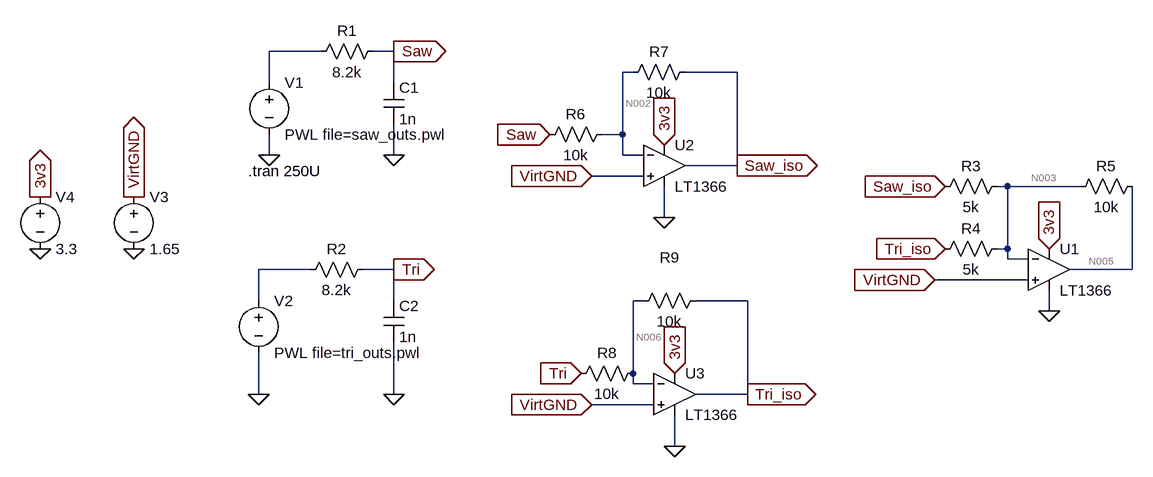
[diagram p0: schematic PulseWidthDAC.asc]
PulseWidthDAC.asc, the LTspice schematic file:
Version 4
SHEET 1 1768 708
WIRE 128 80 48 80
WIRE 240 80 208 80
WIRE 608 112 592 112
WIRE 768 112 688 112
WIRE 48 128 48 80
WIRE 240 128 240 80
WIRE 592 208 592 112
WIRE 592 208 560 208
WIRE 48 240 48 208
WIRE 240 240 240 192
WIRE 592 240 592 208
WIRE 624 240 592 240
WIRE 768 256 768 112
WIRE 768 256 688 256
WIRE 624 272 544 272
WIRE 1184 288 1168 288
WIRE 1296 288 1184 288
WIRE 656 336 656 288
WIRE 1184 384 1184 288
WIRE 1184 384 1168 384
WIRE 1184 400 1184 384
WIRE 1216 400 1184 400
WIRE 112 416 32 416
WIRE 240 416 192 416
WIRE 1376 416 1376 288
WIRE 1376 416 1280 416
WIRE 1216 432 1072 432
WIRE 32 464 32 416
WIRE 240 464 240 416
WIRE 624 464 608 464
WIRE 784 464 704 464
WIRE 1248 480 1248 448
WIRE 608 576 608 464
WIRE 608 592 608 576
WIRE 640 592 608 592
WIRE 32 608 32 544
WIRE 240 608 240 528
WIRE 784 608 784 464
WIRE 784 608 704 608
WIRE 640 624 544 624
WIRE 672 688 672 640
FLAG 240 240 0
FLAG 48 240 0
FLAG 240 608 0
FLAG 32 608 0
FLAG 240 80 Saw
IOPIN 240 80 Out
FLAG 240 416 Tri
IOPIN 240 416 Out
FLAG -160 384 0
FLAG 1248 480 0
FLAG 1248 384 3v3
IOPIN 1248 384 In
FLAG -304 384 0
FLAG -304 304 3v3
IOPIN -304 304 Out
FLAG -160 304 VirtGND
IOPIN -160 304 Out
FLAG 1072 432 VirtGND
IOPIN 1072 432 In
FLAG 544 624 VirtGND
IOPIN 544 624 In
FLAG 544 272 VirtGND
IOPIN 544 272 In
FLAG 656 336 0
FLAG 672 688 0
FLAG 672 576 3v3
IOPIN 672 576 In
FLAG 656 224 3v3
IOPIN 656 224 In
FLAG 480 208 Saw
IOPIN 480 208 In
FLAG 528 576 Tri
IOPIN 528 576 In
FLAG 768 256 Saw_iso
IOPIN 768 256 Out
FLAG 784 608 Tri_iso
IOPIN 784 608 Out
FLAG 1088 288 Saw_iso
IOPIN 1088 288 In
FLAG 1088 384 Tri_iso
IOPIN 1088 384 In
SYMBOL voltage 48 112 R0
WINDOW 123 0 0 Left 0
WINDOW 39 0 0 Left 0
SYMATTR InstName V1
SYMATTR Value PWL file=saw_outs.pwl
SYMBOL res 224 64 R90
WINDOW 0 0 56 VBottom 2
WINDOW 3 32 56 VTop 2
SYMATTR InstName R1
SYMATTR Value 8.2k
SYMBOL cap 224 128 R0
SYMATTR InstName C1
SYMATTR Value 1n
SYMBOL voltage 32 448 R0
WINDOW 123 0 0 Left 0
WINDOW 39 0 0 Left 0
SYMATTR InstName V2
SYMATTR Value PWL file=tri_outs.pwl
SYMBOL res 208 400 R90
WINDOW 0 0 56 VBottom 2
WINDOW 3 32 56 VTop 2
SYMATTR InstName R2
SYMATTR Value 8.2k
SYMBOL cap 224 464 R0
SYMATTR InstName C2
SYMATTR Value 1n
SYMBOL OpAmps\\LT1366 1248 352 R0
SYMATTR InstName U1
SYMBOL voltage -160 288 R0
WINDOW 123 0 0 Left 0
WINDOW 39 0 0 Left 0
SYMATTR InstName V3
SYMATTR Value 1.65
SYMBOL res 1184 272 R90
WINDOW 0 0 56 VBottom 2
WINDOW 3 32 56 VTop 2
SYMATTR InstName R3
SYMATTR Value 5k
SYMBOL res 1184 368 R90
WINDOW 0 0 56 VBottom 2
WINDOW 3 32 56 VTop 2
SYMATTR InstName R4
SYMATTR Value 5k
SYMBOL res 1392 272 R90
WINDOW 0 0 56 VBottom 2
WINDOW 3 32 56 VTop 2
SYMATTR InstName R5
SYMATTR Value 10k
SYMBOL voltage -304 288 R0
WINDOW 123 0 0 Left 0
WINDOW 39 0 0 Left 0
SYMATTR InstName V4
SYMATTR Value 3.3
SYMBOL OpAmps\\LT1366 656 192 R0
SYMATTR InstName U2
SYMBOL OpAmps\\LT1366 672 544 R0
SYMATTR InstName U3
SYMBOL res 576 192 R90
WINDOW 0 0 56 VBottom 2
WINDOW 3 32 56 VTop 2
SYMATTR InstName R6
SYMATTR Value 10k
SYMBOL res 704 96 R90
WINDOW 0 0 56 VBottom 2
WINDOW 3 32 56 VTop 2
SYMATTR InstName R7
SYMATTR Value 10k
SYMBOL res 624 560 R90
WINDOW 0 0 56 VBottom 2
WINDOW 3 32 56 VTop 2
SYMATTR InstName R8
SYMATTR Value 10k
SYMBOL res 720 448 R90
WINDOW 0 -35 56 VBottom 2
WINDOW 3 32 56 VTop 2
SYMATTR InstName R9
SYMATTR Value 10k
TEXT 16 264 Left 2 !.tran 250U

The netlist it stands for:
* PulseWidthDAC.asc
V1 N001 0 PWL file=saw_outs.pwl
R1 Saw N001 8.2k
C1 Saw 0 1n
V2 N004 0 PWL file=tri_outs.pwl
R2 Tri N004 8.2k
C2 Tri 0 1n
XU1 VirtGND N003 3v3 0 N005 LT1366  ; pins In+ In- V+ V- OUT
V3 VirtGND 0 1.65
R3 N003 Saw_iso 5k
R4 N003 Tri_iso 5k
R5 N005 N003 10k
V4 3v3 0 3.3
XU2 VirtGND N002 3v3 0 Saw_iso LT1366  ; pins In+ In- V+ V- OUT
XU3 VirtGND N006 3v3 0 Tri_iso LT1366  ; pins In+ In- V+ V- OUT
R6 N002 Saw 10k
R7 Saw_iso N002 10k
R8 N006 Tri 10k
R9 Tri_iso N006 10k
.tran 250U
.lib LTC.lib
.backanno
.end

* Results of the author's LTspice run, read from the files saved beside the schematic
* Operating Point, zero values left out:
*   V(saw) = 743.4 mV
*   V(tri) = 743.4 mV
*   V(n003) = 2.047 V
*   V(virtgnd) = 1.65 V
*   V(3v3) = 3.3 V
*   V(n005) = 9.114 mV
*   V(saw_iso) = 2.556 V
*   V(tri_iso) = 2.556 V
*   V(n002) = 1.65 V
*   V(n006) = 1.65 V
*   I(R1) = 90.66 µA
*   I(R2) = 90.66 µA
*   I(R3) = -101.9 µA
*   I(R4) = -101.9 µA
*   I(R5) = -203.8 µA
*   I(R6) = 90.66 µA
*   I(R7) = 90.65 µA
*   I(R8) = 90.66 µA
*   I(R9) = 90.65 µA
*   I(V1) = 90.66 µA
*   I(V2) = 90.66 µA
*   I(V3) = 29.97 nA
*   I(V4) = -1.353 mA
*   Ix(u1:1) = -9.99 nA
*   Ix(u1:2) = -9.95 nA
*   Ix(u1:3) = 322.8 µA
*   Ix(u1:4) = -526.6 µA
*   Ix(u1:5) = 203.8 µA
*   Ix(u2:1) = -9.99 nA
*   Ix(u2:2) = -9.99 nA
*   Ix(u2:3) = 515.3 µA
*   Ix(u2:4) = -322.8 µA
*   Ix(u2:5) = -192.5 µA
*   Ix(u3:1) = -9.99 nA
*   Ix(u3:2) = -9.99 nA
*   Ix(u3:3) = 515.3 µA
*   Ix(u3:4) = -322.8 µA
*   Ix(u3:5) = -192.5 µA
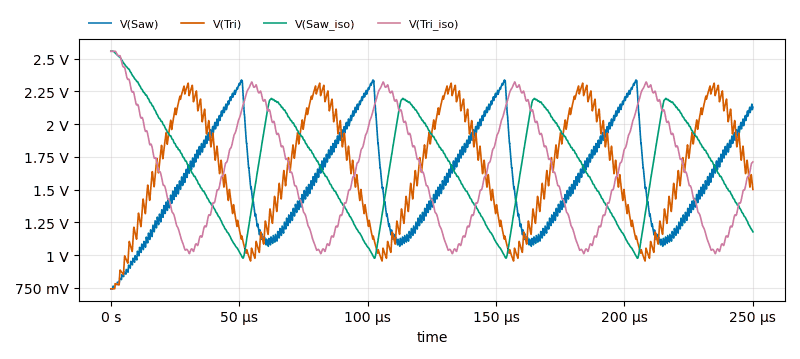
[diagram p1: Transient Analysis of PulseWidthDAC.asc, plotted from the saved traces]
* Transient Analysis, 1 run:
*   V(Saw): min 743.4 mV, max 2.338 V, average 1.587 V, rms 1.637 V, last 2.131 V
*   V(Tri): min 743.4 mV, max 2.313 V, average 1.644 V, rms 1.699 V, last 1.503 V
*   V(Saw_iso): min 977.1 mV, max 2.557 V, average 1.68 V, rms 1.725 V, last 1.178 V
*   V(Tri_iso): min 1.012 V, max 2.557 V, average 1.659 V, rms 1.714 V, last 1.712 V